# Altium schematic sheet volt_sense.SchDoc
size A
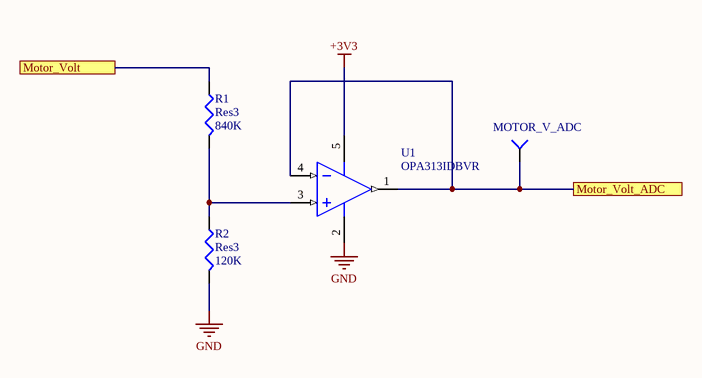
[diagram p0: volt_sense.SchDoc]

## Parts
R1  Res3  value 840K  [J1-0603]
R2  Res3  value 120K  [J1-0603]
TP_Motor_V  MOTOR_V_ADC  [TESTPOINT]
U1  OPA313IDBVR  [DBV0005A_M]

## Ports
Motor_Volt, Motor_Volt_ADC

## Nets
+3V3: U1.5(V+)
GND: R2.2 U1.2(V-)
Motor_Volt: R1.1 ; port Motor_Volt
Motor_Volt_ADC: TP_Motor_V.1(=value) U1.1(OUT) U1.4(IN-) ; port Motor_Volt_ADC
NetR1_2: R1.2 R2.1 U1.3(IN+)

## Library data of the parts
R1 R2 = Res3: Resistor; Published: 8-Jun-2000; LatestRevisionDate: 29-May-2009; LatestRevisionNote: IPC-7351 Footprint Added.; PackageReference: J1-0603; Publisher: Altium Limited; PackageDescription: Chip Resistor
TP_Motor_V = TESTPOINT_SMD: Part Number (MPN): *
U1 = OPAMP: 1-MHz, Micropower, Low-Noise, Rail-to-Rail I/O Operational Amplifier, 1.8 to 5.5 V, -40 to 125 degC, 5-pin SOT23 (DBV5), Green (RoHS & no Sb/Br); Manufacturer: Texas Instruments; Offset Drift(Typ)(uV/C): 2; Rating: Catalog; Packing: LARGE T&R; SubFamily: Low Input Bias Current Amp (<=10pA), Low Power Amp (<=500uA); Number of Channels: 1; Vio (25C)(Max)(mV): 2.5; Total Supply Voltage(Min)(+5V is 5, +/-5V is 10): 1.8; CMRR(Min)(dB): 70; Total Supply Voltage(Max)(+5V is 5, +/-5V is 10): 5.5; Iq per channel(Max)(mA): 0.06; Slew Rate(Typ)(V/us): 0.5; ComponentLink1Description: Manufacturer URL; PackageVersion: 4073253-4/K, 03/2006; ComponentLink2Description: Datasheet; Code_JEDEC: MO-178; GBW(Typ)(MHz): 1; Eco-Plan: Green (RoHS & no Sb/Br); ComponentLink3Description: Package Specification; PartNumber: OPA313IDBVR; PackageReference: DBV0005A; Mounting Technology: Surface Mount; PackageDescription: 5-Pin Plastic Small Outline, Body 1.6 x 2.9 mm, Pitch 0.95 mm; ComponentLink1URL: http://www.ti.com/; DatasheetVersion: SBOS649C; ComponentLink2URL: http://www.ti.com/lit/ds/symlink/opa313.pdf; ComponentLink3URL: http://www.ti.com/litv/pdf/mpds018i; Digi-Key Part Number: 296-35607-1-ND